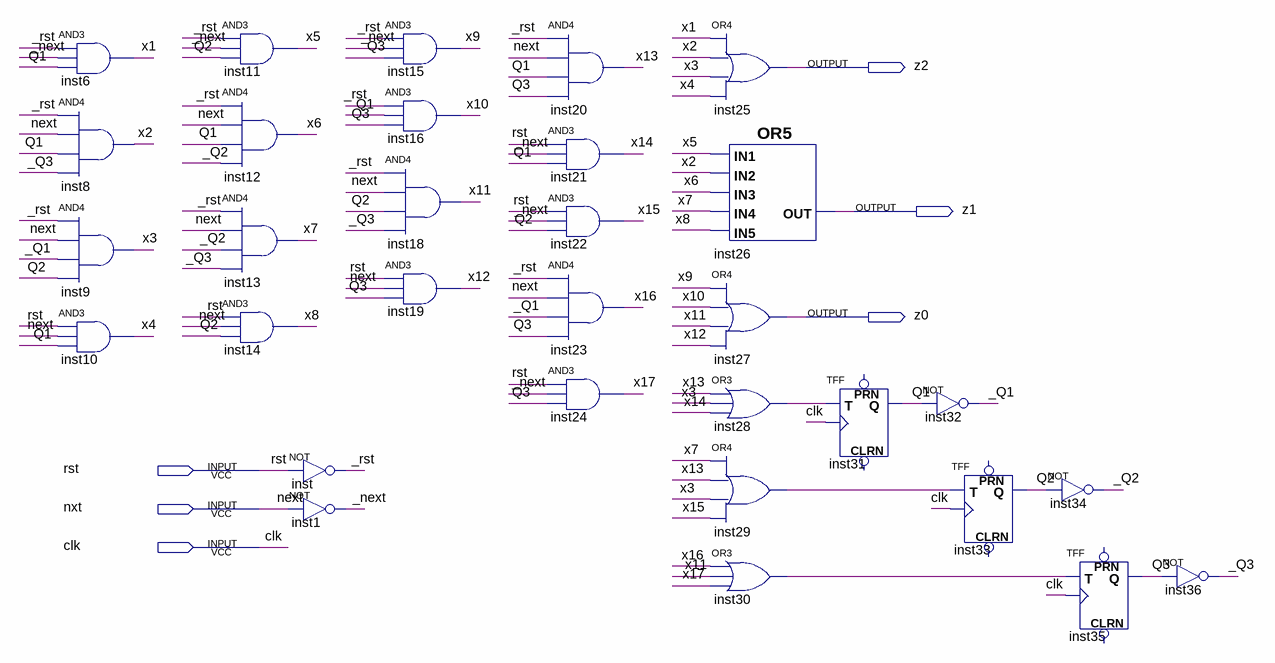
[diagram p0: schematic sheet]
// Quartus schematic PRandom07.bdf as structural Verilog: 31 symbols, 6 pins
module PRandom07 (
  input  rst,
  input  nxt,
  input  clk,
  output z2,
  output z1,
  output z0
);

  wire _next, _Q1, _Q2, _Q3, _rst, inst28_out, inst29_out, inst30_out, Q1, Q2, Q3, x1, x2, x3, x4, x5, x6,
       x7, x8, x9, x10, x11, x12, x13, x14, x15, x16, x17;

  and inst6 (x1, _rst, _next, Q1);
  and inst8 (x2, _rst, nxt, Q1, _Q3);
  and inst9 (x3, _rst, nxt, _Q1, Q2);
  and inst10 (x4, rst, nxt, Q1);
  and inst11 (x5, _rst, _next, Q2);
  and inst12 (x6, _rst, nxt, Q1, _Q2);
  and inst13 (x7, _rst, nxt, _Q2, _Q3);
  and inst14 (x8, rst, nxt, Q2);
  not inst (_rst, rst);
  not inst1 (_next, nxt);
  and inst15 (x9, _rst, _next, Q3);
  and inst16 (x10, _rst, Q1, Q3);
  and inst18 (x11, _rst, nxt, Q2, _Q3);
  and inst19 (x12, rst, nxt, Q3);
  and inst20 (x13, _rst, nxt, Q1, Q3);
  and inst21 (x14, rst, _next, Q1);
  and inst22 (x15, rst, _next, Q2);
  and inst23 (x16, _rst, nxt, _Q1, Q3);
  and inst24 (x17, rst, _next, Q3);
  or inst25 (z2, x1, x2, x3, x4);
  or inst26 (z1, x5, x2, x6, x7, x8);
  or inst27 (z0, x9, x10, x11, x12);
  or inst28 (inst28_out, x13, x3, x14);
  or inst29 (inst29_out, x7, x13, x3, x15);
  or inst30 (inst30_out, x16, x11, x17);
  TFF inst31 (.T(inst28_out), .CLK(clk), .Q(Q1));  // open: PRN, CLRN
  not inst32 (_Q1, Q1);
  TFF inst33 (.T(inst29_out), .CLK(clk), .Q(Q2));  // open: PRN, CLRN
  not inst34 (_Q2, Q2);
  TFF inst35 (.T(inst30_out), .CLK(clk), .Q(Q3));  // open: PRN, CLRN
  not inst36 (_Q3, Q3);

  // Other names for the same wires on the sheet: next = nxt
endmodule
